# Altium schematic sheet SH5 - MICROCONTROLLER.SchDoc: Microcontroller
size B; Organization: UW Robotics; Address1: 200 University Avenue; Address2: Waterloo; Address3: Ontario; Address4: Canada N2L 3G6; DocumentNumber: 7; SheetNumber: 5
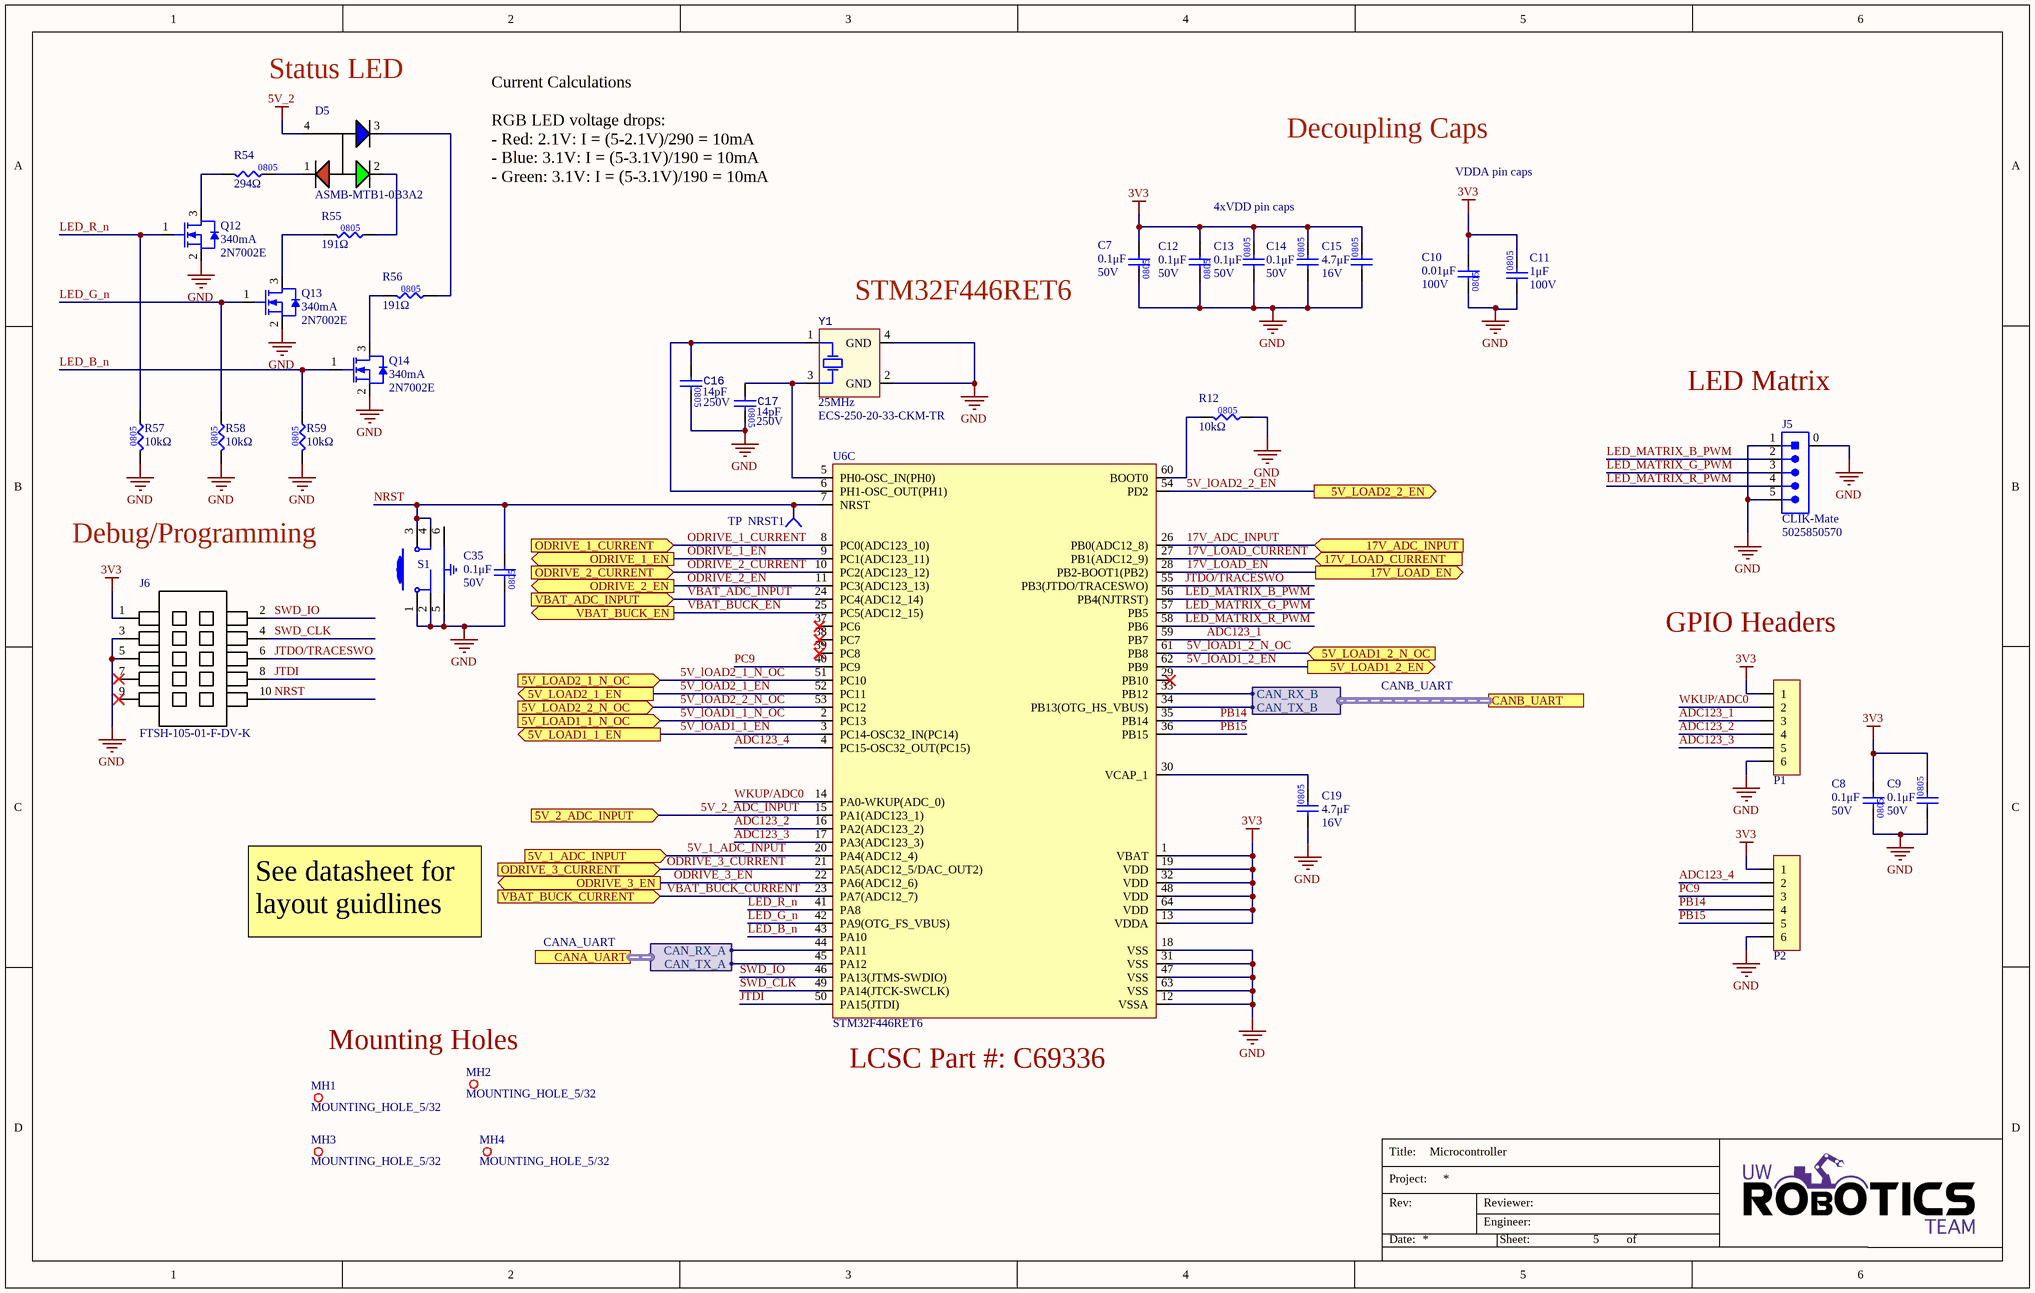
[diagram p0: SH5 - MICROCONTROLLER.SchDoc]

## Parts
C7  value 0.1μF  Voltage Rating: 50V  [CAP2012]  (hidden comment: CAP_0.1uF_50V_0805)
C8  value 0.1μF  Voltage Rating: 50V  [CAP2012]  (hidden comment: CAP_0.1uF_50V_0805)
C9  value 0.1μF  Voltage Rating: 50V  [CAP2012]  (hidden comment: CAP_0.1uF_50V_0805)
C10  value 0.01μF  Voltage Rating: 100V  [CAP0805]  (hidden comment: CAP_0.01uF_100V_0805)
C11  value 1μF  Voltage Rating: 100V  [CAP0805]  (hidden comment: CAP_1uF_100V_0805)
C12  value 0.1μF  Voltage Rating: 50V  [CAP2012]  (hidden comment: CAP_0.1uF_50V_0805)
C13  value 0.1μF  Voltage Rating: 50V  [CAP2012]  (hidden comment: CAP_0.1uF_50V_0805)
C14  value 0.1μF  Voltage Rating: 50V  [CAP2012]  (hidden comment: CAP_0.1uF_50V_0805)
C15  value 4.7μF  Voltage Rating: 16V  [CAP0805]  (hidden comment: CAP_4.7uF_16V_0805)
C16  value 14pF  Voltage Rating: 250V  [CAP0805]  (hidden comment: CAP_14pF_50V_0805)
C17  value 14pF  Voltage Rating: 250V  [CAP0805]  (hidden comment: CAP_14pF_50V_0805)
C19  value 4.7μF  Voltage Rating: 16V  [CAP0805]  (hidden comment: CAP_4.7uF_16V_0805)
C35  value 0.1μF  Voltage Rating: 50V  [CAP2012]  (hidden comment: CAP_0.1uF_50V_0805)
D5  Manufacturer Part Number 1: ASMB-MTB1-0B3A2  [LED_RGB]  (hidden comment: LED_RGB)
J5  Family: CLIK-Mate  Manufacturer Part Number 1: 5025850570  [MOLEX-5025850570]  (hidden comment: CON_5M_SM_RA)
J6  Manufacturer Part Number 1: FTSH-105-01-F-DV-K  [FTSH-105-01-F-DV-K-P-TR]  (hidden comment: CON_PROGRAMMING)
MH1  MOUNTING_HOLE_5/32  [MOUNTING_HOLE_5/38]  (no BOM)
MH2  MOUNTING_HOLE_5/32  [MOUNTING_HOLE_5/38]  (no BOM)
MH3  MOUNTING_HOLE_5/32  [MOUNTING_HOLE_5/38]  (no BOM)
MH4  MOUNTING_HOLE_5/32  [MOUNTING_HOLE_5/38]  (no BOM)
P1  CONN_TERMINAL_6  [CONN_6POS_SIP]  (value not drawn)
P2  CONN_TERMINAL_6  [CONN_6POS_SIP]  (value not drawn)
Q12  Id: 340mA  Manufacturer Part Number 1: 2N7002E  [SOT23-3]  (hidden comment: NMOS_60V_340mS)
Q13  Id: 340mA  Manufacturer Part Number 1: 2N7002E  [SOT23-3]  (hidden comment: NMOS_60V_340mS)
Q14  Id: 340mA  Manufacturer Part Number 1: 2N7002E  [SOT23-3]  (hidden comment: NMOS_60V_340mS)
R12  value 10kΩ  [RES0805]  (hidden comment: RES_10kΩ_0805_5%)
R54  value 294Ω  [RES0805]  (hidden comment: RES_294Ω_0805_1%)
R55  value 191Ω  [RES0805]  (hidden comment: RES_191Ω_0805_1%)
R56  value 191Ω  [RES0805]  (hidden comment: RES_191Ω_0805_1%)
R57  value 10kΩ  [RES0805]  (hidden comment: RES_10kΩ_0805_5%)
R58  value 10kΩ  [RES0805]  (hidden comment: RES_10kΩ_0805_5%)
R59  value 10kΩ  [RES0805]  (hidden comment: RES_10kΩ_0805_5%)
S1  SW_PUSHBUTTON  [TACTILE_SWITCH_SMD]  (value not drawn)
TP_NRST1  TESTPOINT_1MM_CIRCLE  [TESTPOINT_CIRCLE_1MM]  (value not drawn)  (no BOM)
U6  STM32F446RET6  [STM_LQFP64_N]  (part C of 3)
Y1  Frequency: 25MHz  Manufacturer Part Number 1: ECS-250-20-33-CKM-TR  [XTAL_ECS-250-20-33-CKM-TR]  (hidden comment: CRYSTAL_25MHZ_20PF)

## Ports
5V_1_ADC_INPUT (in), 5V_2_ADC_INPUT (in), 5V_LOAD1_1_EN (out), 5V_LOAD1_1_N_OC (in), 5V_LOAD1_2_EN (out), 5V_LOAD1_2_N_OC (in), 5V_LOAD2_1_EN (out), 5V_LOAD2_1_N_OC (in), 5V_LOAD2_2_EN (out), 5V_LOAD2_2_N_OC (in), 17V_ADC_INPUT (in), 17V_LOAD_CURRENT (in), 17V_LOAD_EN (out), CANA_UART (harness CANA_UART), CANB_UART (harness CANB_UART), ODRIVE_1_CURRENT (in), ODRIVE_1_EN (out), ODRIVE_2_CURRENT (in), ODRIVE_2_EN (out), ODRIVE_3_CURRENT (in), ODRIVE_3_EN (out), VBAT_ADC_INPUT (in), VBAT_BUCK_CURRENT (in), VBAT_BUCK_EN (out)

## Harnesses
CANA_UART: CAN_RX_A, CAN_TX_A
CANB_UART: CAN_RX_B, CAN_TX_B

## Nets
3V3: C7.2 C8.2 C9.2 C10.2 C11.2 C12.2 C13.2 C14.2 C15.2 J6.1 P1.1 P2.1 U6.1(VBAT) U6.13(VDDA) U6.19(VDD) U6.32(VDD) U6.48(VDD) U6.64(VDD)
5V_2: D5.4(COMMON_ANODE)
GND: C7.1 C8.1 C9.1 C10.1 C11.1 C12.1 C13.1 C14.1 C15.1 C16.2 C17.2 C19.1 C35.1 J5.0 J5.1 J5.5 J6.3 J6.5 P1.6 P2.6 Q12.2(Source) Q13.2(Source) Q14.2(Source) R12.1 R57.2 R58.2 R59.2 S1.1 S1.2 S1.5 U6.12(VSSA) U6.18(VSS) U6.31(VSS) U6.47(VSS) U6.63(VSS) Y1.2(GND) Y1.4(GND)
5V_1_ADC_INPUT: U6.20(PA4(ADC12_4)) ; port 5V_1_ADC_INPUT
5V_2_ADC_INPUT: U6.15(PA1(ADC123_1)) ; port 5V_2_ADC_INPUT
5V_lOAD1_1_EN: U6.3(PC14-OSC32_IN(PC14)) ; port 5V_LOAD1_1_EN
5V_lOAD1_1_N_OC: U6.2(PC13) ; port 5V_LOAD1_1_N_OC
5V_lOAD1_2_EN: U6.62(PB9) ; port 5V_LOAD1_2_EN
5V_lOAD1_2_N_OC: U6.61(PB8) ; port 5V_LOAD1_2_N_OC
5V_lOAD2_1_EN: U6.52(PC11) ; port 5V_LOAD2_1_EN
5V_lOAD2_1_N_OC: U6.51(PC10) ; port 5V_LOAD2_1_N_OC
5V_lOAD2_2_EN: U6.54(PD2) ; port 5V_LOAD2_2_EN
5V_lOAD2_2_N_OC: U6.53(PC12) ; port 5V_LOAD2_2_N_OC
17V_ADC_INPUT: U6.26(PB0(ADC12_8)) ; port 17V_ADC_INPUT
17V_LOAD_CURRENT: U6.27(PB1(ADC12_9)) ; port 17V_LOAD_CURRENT
17V_LOAD_EN: U6.28(PB2-BOOT1(PB2)) ; port 17V_LOAD_EN
ADC123_1: P1.3 U6.59(PB7)
ADC123_2: P1.4 U6.16(PA2(ADC123_2))
ADC123_3: P1.5 U6.17(PA3(ADC123_3))
ADC123_4: P2.2 U6.4(PC15-OSC32_OUT(PC15))
JTDI: J6.8 U6.50(PA15(JTDI))
JTDO/TRACESWO: J6.6 U6.55(PB3(JTDO/TRACESWO))
LED_B_n: Q14.1(Gate) R59.1 U6.43(PA10)
LED_G_n: Q13.1(Gate) R58.1 U6.42(PA9(OTG_FS_VBUS))
LED_MATRIX_B_PWM: J5.2 U6.56(PB4(NJTRST))
LED_MATRIX_G_PWM: J5.3 U6.57(PB5)
LED_MATRIX_R_PWM: J5.4 U6.58(PB6)
LED_R_n: Q12.1(Gate) R57.1 U6.41(PA8)
NRST: C35.2 J6.10 S1.3 S1.4 TP_NRST1.1(=value) U6.7(NRST)
ODRIVE_1_CURRENT: U6.8(PC0(ADC123_10)) ; port ODRIVE_1_CURRENT
ODRIVE_1_EN: U6.9(PC1(ADC123_11)) ; port ODRIVE_1_EN
ODRIVE_2_CURRENT: U6.10(PC2(ADC123_12)) ; port ODRIVE_2_CURRENT
ODRIVE_2_EN: U6.11(PC3(ADC123_13)) ; port ODRIVE_2_EN
ODRIVE_3_CURRENT: U6.21(PA5(ADC12_5/DAC_OUT2)) ; port ODRIVE_3_CURRENT
ODRIVE_3_EN: U6.22(PA6(ADC12_6)) ; port ODRIVE_3_EN
PB14: P2.4 U6.35(PB14)
PB15: P2.5 U6.36(PB15)
PC9: P2.3 U6.40(PC9)
SWD_CLK: J6.4 U6.49(PA14(JTCK-SWCLK))
SWD_IO: J6.2 U6.46(PA13(JTMS-SWDIO))
VBAT_ADC_INPUT: U6.24(PC4(ADC12_14)) ; port VBAT_ADC_INPUT
VBAT_BUCK_CURRENT: U6.23(PA7(ADC12_7)) ; port VBAT_BUCK_CURRENT
VBAT_BUCK_EN: U6.25(PC5(ADC12_15)) ; port VBAT_BUCK_EN
WKUP/ADC0: P1.2 U6.14(PA0-WKUP(ADC_0))
NetC16_1: C16.1 U6.6(PH1-OSC_OUT(PH1)) Y1.1(HOT)
NetC17_1: C17.1 U6.5(PH0-OSC_IN(PH0)) Y1.3(HOT)
NetC19_2: C19.2 U6.30(VCAP_1)
NetD5_1: D5.1(CATHODE_(RED)) R54.2
NetD5_2: D5.2(CATHODE_(GREEN)) R55.1
NetD5_3: D5.3(CATHODE_(BLUE)) R56.1
NetQ12_3: Q12.3(Drain) R54.1
NetQ13_3: Q13.3(Drain) R55.2
NetQ14_3: Q14.3(Drain) R56.2
NetR12_2: R12.2 U6.60(BOOT0)
NetU6_33: U6.33(PB12) ; port CANB_UART.CAN_RX_B
NetU6_34: U6.34(PB13(OTG_HS_VBUS)) ; port CANB_UART.CAN_TX_B
NetU6_44: U6.44(PA11) ; port CANA_UART.CAN_RX_A
NetU6_45: U6.45(PA12) ; port CANA_UART.CAN_TX_A

Not connected (* = marked no-connect by the designer): J6 7* 9*; S1 6; U6 29(PB10)* 37(PC6)* 38(PC7)* 39(PC8)*

## Notes on the sheet
- (near D5) Status LED
- Decoupling Caps
- Current Calculations
  RGB LED voltage drops:
  - Red: 2.1V: I = (5-2.1V)/290 = 10mA
  - Blue: 3.1V: I = (5-3.1V)/190 = 10mA
  - Green: 3.1V: I = (5-3.1V)/190 = 10mA
- 4xVDD pin caps
- VDDA pin caps
- (near Y1) STM32F446RET6
- (near J5) LED Matrix
- Debug/Programming
- GPIO Headers
- See datasheet for layout guidlines
- Mounting Holes
- (near U6) LCSC Part #: C69336
- Title:
- Project:
- Date:
- Rev:
- Reviewer:
- Engineer:
- Sheet:
- of

## Library data of the parts
C7-C9 C12-C14 C35 = CAP_0.1uF_50V_0805: CAP CER 0.1UF 50V X7R 0805; Manufacturer Part Number 1: GCM21BR71H104KA37K; Manufacturer 1: Murata Electronics; Package/Footprint: 0805; Supplier Part Number 1: 490-8049-1-ND; Supplier 1: Digi-Key; Dielectric: X7R; LCSC Part #: C49678; Mounting Type: SMD
C10 = CAP_0.01uF_100V_0805: CAP CER 0.01uF 100V X7R 0805; Manufacturer Part Number 1: 08051C103KAT2A; Manufacturer 1: AVX Corporation; Supplier Part Number 1: 478-1358-1-ND; Supplier 1: Digi-Key; Dielectric: X7R; LCSC Part #: C1710; Mounting Type: SMD; Package: 0805
C11 = CAP_1uF_100V_0805: CAP CER 1UF 100V X7S 0805; Supplier 1: Digi-Key; Mounting Type: SMD; Package: 0805; Supplier Part Number 1: 490-14464-1-ND
C15 C19 = CAP_4.7uF_16V_0805: CAP CER 4.7UF 16V X5R 0805; Manufacturer Part Number 1: CL21A475KOFNNNE; Manufacturer 1: Samsung Electro-Mechanics; Supplier Part Number 1: 1276-1065-1-ND; Supplier 1: Digi-Key; Dielectric: X5R; LCSC Part #: C1779; Mounting Type: SMD; Package: 0805
C16 C17 = CAP_14pF_50V_0805: CERAMIC CAP MLCC HIGH-Q 125C; Manufacturer: Murata Electronics; Manufacturer Part Number: GQM2195C2E140JB12D; Mounting Type: SMD; Package: 0805; Supplier 1: Digi-Key; Supplier Part Number 1: 490-GQM2195C2E140JB12DCT-ND
D5 = LED_RGB: LED RGB DIFFUSED 4PLCC SMD; Manufacturer 1: Broadcom; Color: Blue,Green,Red; Lens Color: White; Viewing Angle: 115°; Lens Style: Round; Luminous Intensity: 350mcd; Dominant Wavelength: 470nm; Forward Voltage: 3.1V; Test Current: 20mA; Package/Footprint: 4-PLCC; Supplier 1: Digi-Key; Number of Pins: 4; Lens Transparency: Diffused; Supplier Part Number 1: 516-ASMB-MTB1-0B3A2CT-ND; Mounting Type: SMD
J5 = CON_5M_SM_RA: CONN HEADER SMD RIGHT ANGLE 1.5MM PITCH; Manufacturer 1: Molex; Current Rating: 2A; Supplier 1: Digi-Key; Supplier Part Number 1: WM14469CT-ND; Orientation: Right Angle; Mounting Type: SMD; Package/Footprint: SMD
J6 = CON_PROGRAMMING: CONN HEADER SMD 10POS 1.27MM; Manufacturer 1: Samtec; Supplier 1: Digi-Key; Pitch: 1.27mm; Supplier Part Number 1: SAM8796-ND; Mounting Type: SMD
P1 P2 = CONN_SIP_6: Header, 6-Pin, SIP
Q12-Q14 = NMOS_60V_340mS: N-Channel 60 V 340mA (Ta) 350mW (Ta) Surface Mount SOT-23; Manufacturer 1: ANBON SEMICONDUCTOR (INT'L) LIMITED; Vgs (Max): ±20V; Vdss: 60V; Supplier 1: Digi-Key; Supplier Part Number 1: 4530-2N7002ECT-ND; Mounting Type: SMD; Package/Footprint: SOT-23; Verified: No
R12 R57-R59 = RES_10kΩ_0805_5%: RES 10K OHM 5% 1/8W 0805; Manufacturer 1: Panasonic Electronic Components; Manufacturer Part Number 1: ERJ-6GEYJ103V; Package/Footprint: 0805; Supplier Part Number 1: P10KACT-ND; Supplier 1: Digi-Key; LCSC Part #: C17414; Mounting Type: SMD
R54 = RES_294Ω_0805_1%: RES 402 OHM 1% 1/8W 0805; Manufacturer 1: Rohm Semiconductor; Manufacturer Part Number 1: MCR10ERTF2940; Package/Footprint: 0805; Supplier 1: Digi-Key; Supplier Part Number 1: RHM294CHCT-ND; Mounting Type: SMD
R55 R56 = RES_191Ω_0805_1%: RES 402 OHM 1% 1/8W 0805; Manufacturer 1: YAGEO; Manufacturer Part Number 1: RC0805FR-07191RL; Package/Footprint: 0805; Supplier 1: Digi-Key; Supplier Part Number 1: 311-191CRCT-ND; Mounting Type: SMD
S1 = SW_PUSHBUTTON: SMT 3.0 X 2.6 MM TACT SWITCH WIT; Manufacturer Part Number 1: 435151014824; Manufacturer 1: Würth Elektronik; Supplier 1: Digi-Key; Supplier Part Number 1: 732-435151014824CT-ND
TP_NRST1 = TESTPOINT_1MM_CIRCLE: TESTPOINT 1MM CIRCLE
U6 = STM32F446RET6: IC MCU 32BIT 512KB FLASH 64LQFP; Manufacturer 1: STMicroelectronics; Manufacturer Part Number 1: LF80CDT-TR; Supplier 1: Digi-Key; Supplier Part Number 1: 497-15376-ND
Y1 = CRYSTAL_25MHZ_20PF: CRYSTAL 25.0000MHZ 20PF SMD; Manufacturer 1: ECS Inc.; Load Capacitance: 20pF; Supplier 1: Digi-Key; Supplier Part Number 1: XC1817CT-ND; Mounting Type: SMD; Package/Footprint: SMD